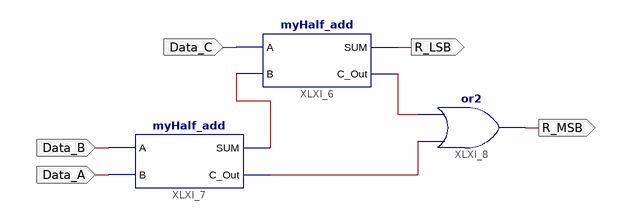
[diagram p0: schematic sheet 1]
// Xilinx ISE schematic Prog00.sch (xc9500) as structural Verilog: 3 symbols, 5 ports
module Prog00 (
  input  Data_C,
  input  Data_B,
  input  Data_A,
  output R_LSB,
  output R_MSB
);

  wire XLXN_22, XLXN_23, XLXN_24;

  myHalf_add XLXI_6 (.A(Data_C), .B(XLXN_22), .C_Out(XLXN_24), .SUM(R_LSB));
  myHalf_add XLXI_7 (.A(Data_B), .B(Data_A), .C_Out(XLXN_23), .SUM(XLXN_22));
  or XLXI_8 (R_MSB, XLXN_23, XLXN_24);
endmodule
